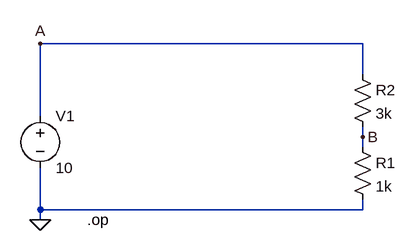
[diagram p0: schematic Exemplo_CC.asc]
Exemplo_CC.asc, the LTspice schematic file:
Version 4
SHEET 1 880 680
WIRE 112 -48 -384 -48
WIRE 112 0 112 -48
WIRE -384 64 -384 -48
WIRE 112 96 112 80
WIRE 112 112 112 96
WIRE -384 208 -384 144
WIRE 112 208 112 192
WIRE 112 208 -384 208
WIRE -384 224 -384 208
FLAG -384 224 0
FLAG -384 -48 A
FLAG 112 96 B
SYMBOL res 96 96 R0
SYMATTR InstName R1
SYMATTR Value 1k
SYMBOL res 96 -16 R0
SYMATTR InstName R2
SYMATTR Value 3k
SYMBOL voltage -384 48 R0
WINDOW 123 0 0 Left 0
WINDOW 39 0 0 Left 0
SYMATTR InstName V1
SYMATTR Value 10
TEXT -312 224 Left 2 !.op

The netlist it stands for:
* Exemplo_CC.asc
R1 B 0 1k
R2 A B 3k
V1 A 0 10
.op
.backanno
.end

* Results of the author's LTspice run, read from the files saved beside the schematic
* Operating Point:
*   V(b) = 2.5 V
*   V(a) = 10 V
*   I(R1) = 2.5 mA
*   I(R2) = 2.5 mA
*   I(V1) = -2.5 mA